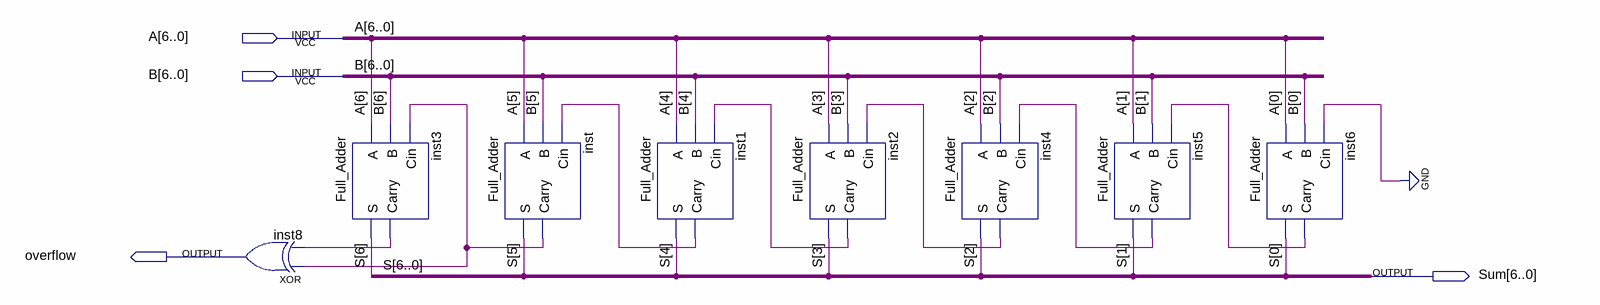
[diagram p0: schematic sheet]
// Quartus schematic Seven_bit_Adder.bdf as structural Verilog: 8 symbols, 4 pins
module Seven_bit_Adder (
  input  [6:0] A,
  input  [6:0] B,
  output overflow,
  output [6:0] Sum
);

  wire inst1_carry, inst2_carry, inst3_carry, inst4_carry, inst5_carry, inst6_carry, inst_carry;

  xor inst8 (overflow, inst_carry, inst3_carry);
  Full_Adder inst3 (.A(A[6]), .B(B[6]), .Cin(inst_carry), .S(Sum[6]), .Carry(inst3_carry));
  Full_Adder inst (.A(A[5]), .B(B[5]), .Cin(inst1_carry), .S(Sum[5]), .Carry(inst_carry));
  Full_Adder inst1 (.A(A[4]), .B(B[4]), .Cin(inst2_carry), .S(Sum[4]), .Carry(inst1_carry));
  Full_Adder inst2 (.A(A[3]), .B(B[3]), .Cin(inst4_carry), .S(Sum[3]), .Carry(inst2_carry));
  Full_Adder inst4 (.A(A[2]), .B(B[2]), .Cin(inst5_carry), .S(Sum[2]), .Carry(inst4_carry));
  Full_Adder inst5 (.A(A[1]), .B(B[1]), .Cin(inst6_carry), .S(Sum[1]), .Carry(inst5_carry));
  Full_Adder inst6 (.A(A[0]), .B(B[0]), .Cin(1'b0), .S(Sum[0]), .Carry(inst6_carry));

  // Other names for the same wires on the sheet: S[6:0] = Sum
endmodule
